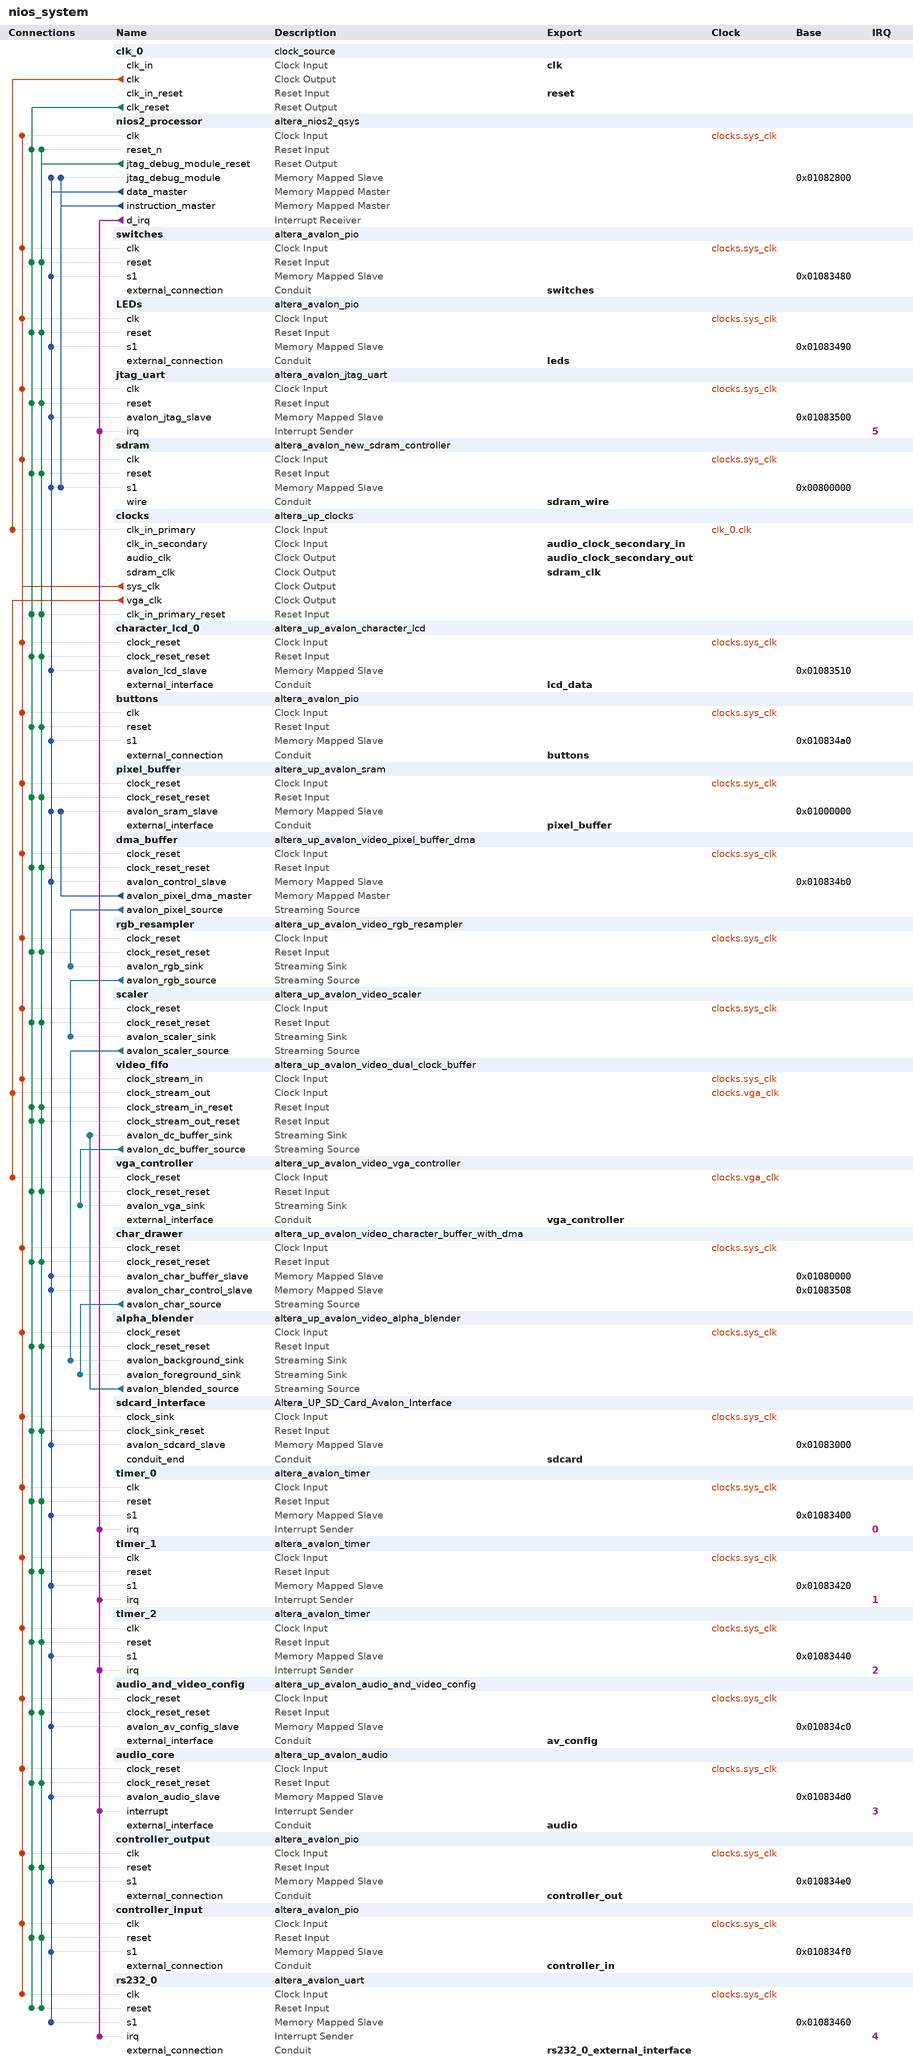
[diagram p0: system contents]
# Platform Designer (Qsys) system nios_system, Cyclone II EP2C35F672C6
# Parameters at their usual value, and those the tool derives, are not listed.
package require -exact qsys 12.0
create_system nios_system
set_project_property DEVICE_FAMILY {Cyclone II}
set_project_property DEVICE EP2C35F672C6

add_instance clk_0 clock_source 12.0
set_instance_parameter_value clk_0 clockFrequency 50000000

add_instance nios2_processor altera_nios2_qsys 12.0
set_instance_parameter_value nios2_processor muldiv_divider true
set_instance_parameter_value nios2_processor resetSlave sdram.s1
set_instance_parameter_value nios2_processor exceptionSlave sdram.s1
set_instance_parameter_value nios2_processor breakSlave nios2_processor.jtag_debug_module
set_instance_parameter_value nios2_processor impl Fast
set_instance_parameter_value nios2_processor icache_size 16384

add_instance switches altera_avalon_pio 12.0
set_instance_parameter_value switches direction Input
set_instance_parameter_value switches width 8

add_instance LEDs altera_avalon_pio 12.0
set_instance_parameter_value LEDs direction Output
set_instance_parameter_value LEDs width 8

add_instance jtag_uart altera_avalon_jtag_uart 12.0
set_instance_parameter_value jtag_uart simInteractiveOptions INTERACTIVE_ASCII_OUTPUT

add_instance sdram altera_avalon_new_sdram_controller 12.0
set_instance_parameter_value sdram TAC 5.5
set_instance_parameter_value sdram TRCD 20.0
set_instance_parameter_value sdram TRP 20.0
set_instance_parameter_value sdram casLatency 3
set_instance_parameter_value sdram columnWidth 8
set_instance_parameter_value sdram dataWidth 16
set_instance_parameter_value sdram generateSimulationModel false
set_instance_parameter_value sdram model custom
set_instance_parameter_value sdram numberOfBanks 4
set_instance_parameter_value sdram numberOfChipSelects 1
set_instance_parameter_value sdram powerUpDelay 100.0
set_instance_parameter_value sdram refreshPeriod 15.625
set_instance_parameter_value sdram rowWidth 12

add_instance clocks altera_up_clocks 12.0
set_instance_parameter_value clocks board DE2
set_instance_parameter_value clocks vga_clk true
set_instance_parameter_value clocks audio_clk true
set_instance_parameter_value clocks audio_clk_freq 12.288

add_instance character_lcd_0 altera_up_avalon_character_lcd 12.0
set_instance_parameter_value character_lcd_0 cursor Normal

add_instance buttons altera_avalon_pio 12.0
set_instance_parameter_value buttons direction Input
set_instance_parameter_value buttons width 4

add_instance pixel_buffer altera_up_avalon_sram 12.0
set_instance_parameter_value pixel_buffer board DE2
set_instance_parameter_value pixel_buffer pixel_buffer true

add_instance dma_buffer altera_up_avalon_video_pixel_buffer_dma 12.0
set_instance_parameter_value dma_buffer addr_mode Consecutive
set_instance_parameter_value dma_buffer start_address 0
set_instance_parameter_value dma_buffer back_start_address 0
set_instance_parameter_value dma_buffer image_width 320
set_instance_parameter_value dma_buffer image_height 240
set_instance_parameter_value dma_buffer color_space {16-bit RGB}

add_instance rgb_resampler altera_up_avalon_video_rgb_resampler 12.0
set_instance_parameter_value rgb_resampler input_type {16-bit RGB}
set_instance_parameter_value rgb_resampler output_type {30-bit RGB}
set_instance_parameter_value rgb_resampler alpha 1023

add_instance scaler altera_up_avalon_video_scaler 12.0
set_instance_parameter_value scaler width_scaling 2
set_instance_parameter_value scaler height_scaling 2
set_instance_parameter_value scaler width_in 320
set_instance_parameter_value scaler color_bits 10
set_instance_parameter_value scaler color_planes 3

add_instance video_fifo altera_up_avalon_video_dual_clock_buffer 12.0
set_instance_parameter_value video_fifo color_bits 10

add_instance vga_controller altera_up_avalon_video_vga_controller 12.0
set_instance_parameter_value vga_controller board DE2

add_instance char_drawer altera_up_avalon_video_character_buffer_with_dma 12.0
set_instance_parameter_value char_drawer enable_transparency true

add_instance alpha_blender altera_up_avalon_video_alpha_blender 12.0

add_instance sdcard_interface Altera_UP_SD_Card_Avalon_Interface 1.0

add_instance timer_0 altera_avalon_timer 12.0
set_instance_parameter_value timer_0 period 1
set_instance_parameter_value timer_0 periodUnits MSEC
set_instance_parameter_value timer_0 timerPreset FULL_FEATURED

add_instance timer_1 altera_avalon_timer 12.0
set_instance_parameter_value timer_1 period 1
set_instance_parameter_value timer_1 periodUnits MSEC
set_instance_parameter_value timer_1 timerPreset FULL_FEATURED

add_instance timer_2 altera_avalon_timer 12.0
set_instance_parameter_value timer_2 period 1
set_instance_parameter_value timer_2 periodUnits MSEC
set_instance_parameter_value timer_2 timerPreset FULL_FEATURED

add_instance audio_and_video_config altera_up_avalon_audio_and_video_config 12.0
set_instance_parameter_value audio_and_video_config board DE2
set_instance_parameter_value audio_and_video_config audio_in {Microphone to ADC}
set_instance_parameter_value audio_and_video_config line_in_bypass false
set_instance_parameter_value audio_and_video_config bit_length 16
set_instance_parameter_value audio_and_video_config sampling_rate {32 kHz}

add_instance audio_core altera_up_avalon_audio 12.0
set_instance_parameter_value audio_core avalon_bus_type {Memory Mapped}
set_instance_parameter_value audio_core audio_in true
set_instance_parameter_value audio_core dw 16

add_instance controller_output altera_avalon_pio 12.0
set_instance_parameter_value controller_output direction Output
set_instance_parameter_value controller_output width 8

add_instance controller_input altera_avalon_pio 12.0
set_instance_parameter_value controller_input direction Input
set_instance_parameter_value controller_input width 8

add_instance rs232_0 altera_avalon_uart 12.0
set_instance_parameter_value rs232_0 baud 115200
set_instance_parameter_value rs232_0 dataBits 8
set_instance_parameter_value rs232_0 fixedBaud true
set_instance_parameter_value rs232_0 parity NONE
set_instance_parameter_value rs232_0 stopBits 1

# connections
add_connection clk_0.clk clocks.clk_in_primary clock
add_connection clocks.sys_clk alpha_blender.clock_reset clock
add_connection clocks.sys_clk audio_and_video_config.clock_reset clock
add_connection clocks.sys_clk audio_core.clock_reset clock
add_connection clocks.sys_clk buttons.clk clock
add_connection clocks.sys_clk char_drawer.clock_reset clock
add_connection clocks.sys_clk character_lcd_0.clock_reset clock
add_connection clocks.sys_clk controller_input.clk clock
add_connection clocks.sys_clk controller_output.clk clock
add_connection clocks.sys_clk dma_buffer.clock_reset clock
add_connection clocks.sys_clk jtag_uart.clk clock
add_connection clocks.sys_clk LEDs.clk clock
add_connection clocks.sys_clk nios2_processor.clk clock
add_connection clocks.sys_clk pixel_buffer.clock_reset clock
add_connection clocks.sys_clk rgb_resampler.clock_reset clock
add_connection clocks.sys_clk rs232_0.clk clock
add_connection clocks.sys_clk scaler.clock_reset clock
add_connection clocks.sys_clk sdcard_interface.clock_sink clock
add_connection clocks.sys_clk sdram.clk clock
add_connection clocks.sys_clk switches.clk clock
add_connection clocks.sys_clk timer_0.clk clock
add_connection clocks.sys_clk timer_1.clk clock
add_connection clocks.sys_clk timer_2.clk clock
add_connection clocks.sys_clk video_fifo.clock_stream_in clock
add_connection clocks.vga_clk vga_controller.clock_reset clock
add_connection clocks.vga_clk video_fifo.clock_stream_out clock
add_connection clk_0.clk_reset alpha_blender.clock_reset_reset reset
add_connection clk_0.clk_reset audio_and_video_config.clock_reset_reset reset
add_connection clk_0.clk_reset audio_core.clock_reset_reset reset
add_connection clk_0.clk_reset buttons.reset reset
add_connection clk_0.clk_reset char_drawer.clock_reset_reset reset
add_connection clk_0.clk_reset character_lcd_0.clock_reset_reset reset
add_connection clk_0.clk_reset clocks.clk_in_primary_reset reset
add_connection clk_0.clk_reset controller_input.reset reset
add_connection clk_0.clk_reset controller_output.reset reset
add_connection clk_0.clk_reset dma_buffer.clock_reset_reset reset
add_connection clk_0.clk_reset jtag_uart.reset reset
add_connection clk_0.clk_reset LEDs.reset reset
add_connection clk_0.clk_reset nios2_processor.reset_n reset
add_connection clk_0.clk_reset pixel_buffer.clock_reset_reset reset
add_connection clk_0.clk_reset rgb_resampler.clock_reset_reset reset
add_connection clk_0.clk_reset rs232_0.reset reset
add_connection clk_0.clk_reset scaler.clock_reset_reset reset
add_connection clk_0.clk_reset sdcard_interface.clock_sink_reset reset
add_connection clk_0.clk_reset sdram.reset reset
add_connection clk_0.clk_reset switches.reset reset
add_connection clk_0.clk_reset timer_0.reset reset
add_connection clk_0.clk_reset timer_1.reset reset
add_connection clk_0.clk_reset timer_2.reset reset
add_connection clk_0.clk_reset vga_controller.clock_reset_reset reset
add_connection clk_0.clk_reset video_fifo.clock_stream_in_reset reset
add_connection clk_0.clk_reset video_fifo.clock_stream_out_reset reset
add_connection nios2_processor.jtag_debug_module_reset alpha_blender.clock_reset_reset reset
add_connection nios2_processor.jtag_debug_module_reset audio_and_video_config.clock_reset_reset reset
add_connection nios2_processor.jtag_debug_module_reset audio_core.clock_reset_reset reset
add_connection nios2_processor.jtag_debug_module_reset buttons.reset reset
add_connection nios2_processor.jtag_debug_module_reset char_drawer.clock_reset_reset reset
add_connection nios2_processor.jtag_debug_module_reset character_lcd_0.clock_reset_reset reset
add_connection nios2_processor.jtag_debug_module_reset clocks.clk_in_primary_reset reset
add_connection nios2_processor.jtag_debug_module_reset controller_input.reset reset
add_connection nios2_processor.jtag_debug_module_reset controller_output.reset reset
add_connection nios2_processor.jtag_debug_module_reset dma_buffer.clock_reset_reset reset
add_connection nios2_processor.jtag_debug_module_reset jtag_uart.reset reset
add_connection nios2_processor.jtag_debug_module_reset LEDs.reset reset
add_connection nios2_processor.jtag_debug_module_reset nios2_processor.reset_n reset
add_connection nios2_processor.jtag_debug_module_reset pixel_buffer.clock_reset_reset reset
add_connection nios2_processor.jtag_debug_module_reset rgb_resampler.clock_reset_reset reset
add_connection nios2_processor.jtag_debug_module_reset rs232_0.reset reset
add_connection nios2_processor.jtag_debug_module_reset scaler.clock_reset_reset reset
add_connection nios2_processor.jtag_debug_module_reset sdcard_interface.clock_sink_reset reset
add_connection nios2_processor.jtag_debug_module_reset sdram.reset reset
add_connection nios2_processor.jtag_debug_module_reset switches.reset reset
add_connection nios2_processor.jtag_debug_module_reset timer_0.reset reset
add_connection nios2_processor.jtag_debug_module_reset timer_1.reset reset
add_connection nios2_processor.jtag_debug_module_reset timer_2.reset reset
add_connection nios2_processor.jtag_debug_module_reset vga_controller.clock_reset_reset reset
add_connection nios2_processor.jtag_debug_module_reset video_fifo.clock_stream_in_reset reset
add_connection nios2_processor.jtag_debug_module_reset video_fifo.clock_stream_out_reset reset
add_connection dma_buffer.avalon_pixel_dma_master pixel_buffer.avalon_sram_slave avalon
set_connection_parameter_value dma_buffer.avalon_pixel_dma_master/pixel_buffer.avalon_sram_slave baseAddress 0x01000000
add_connection nios2_processor.data_master audio_and_video_config.avalon_av_config_slave avalon
set_connection_parameter_value nios2_processor.data_master/audio_and_video_config.avalon_av_config_slave baseAddress 0x010834c0
add_connection nios2_processor.data_master audio_core.avalon_audio_slave avalon
set_connection_parameter_value nios2_processor.data_master/audio_core.avalon_audio_slave baseAddress 0x010834d0
add_connection nios2_processor.data_master buttons.s1 avalon
set_connection_parameter_value nios2_processor.data_master/buttons.s1 baseAddress 0x010834a0
add_connection nios2_processor.data_master char_drawer.avalon_char_buffer_slave avalon
set_connection_parameter_value nios2_processor.data_master/char_drawer.avalon_char_buffer_slave baseAddress 0x01080000
add_connection nios2_processor.data_master char_drawer.avalon_char_control_slave avalon
set_connection_parameter_value nios2_processor.data_master/char_drawer.avalon_char_control_slave baseAddress 0x01083508
add_connection nios2_processor.data_master character_lcd_0.avalon_lcd_slave avalon
set_connection_parameter_value nios2_processor.data_master/character_lcd_0.avalon_lcd_slave baseAddress 0x01083510
add_connection nios2_processor.data_master controller_input.s1 avalon
set_connection_parameter_value nios2_processor.data_master/controller_input.s1 baseAddress 0x010834f0
add_connection nios2_processor.data_master controller_output.s1 avalon
set_connection_parameter_value nios2_processor.data_master/controller_output.s1 baseAddress 0x010834e0
add_connection nios2_processor.data_master dma_buffer.avalon_control_slave avalon
set_connection_parameter_value nios2_processor.data_master/dma_buffer.avalon_control_slave baseAddress 0x010834b0
add_connection nios2_processor.data_master jtag_uart.avalon_jtag_slave avalon
set_connection_parameter_value nios2_processor.data_master/jtag_uart.avalon_jtag_slave baseAddress 0x01083500
add_connection nios2_processor.data_master LEDs.s1 avalon
set_connection_parameter_value nios2_processor.data_master/LEDs.s1 baseAddress 0x01083490
add_connection nios2_processor.data_master nios2_processor.jtag_debug_module avalon
set_connection_parameter_value nios2_processor.data_master/nios2_processor.jtag_debug_module baseAddress 0x01082800
add_connection nios2_processor.data_master pixel_buffer.avalon_sram_slave avalon
set_connection_parameter_value nios2_processor.data_master/pixel_buffer.avalon_sram_slave baseAddress 0x01000000
add_connection nios2_processor.data_master rs232_0.s1 avalon
set_connection_parameter_value nios2_processor.data_master/rs232_0.s1 baseAddress 0x01083460
add_connection nios2_processor.data_master sdcard_interface.avalon_sdcard_slave avalon
set_connection_parameter_value nios2_processor.data_master/sdcard_interface.avalon_sdcard_slave baseAddress 0x01083000
add_connection nios2_processor.data_master sdram.s1 avalon
set_connection_parameter_value nios2_processor.data_master/sdram.s1 baseAddress 0x00800000
add_connection nios2_processor.data_master switches.s1 avalon
set_connection_parameter_value nios2_processor.data_master/switches.s1 baseAddress 0x01083480
add_connection nios2_processor.data_master timer_0.s1 avalon
set_connection_parameter_value nios2_processor.data_master/timer_0.s1 baseAddress 0x01083400
add_connection nios2_processor.data_master timer_1.s1 avalon
set_connection_parameter_value nios2_processor.data_master/timer_1.s1 baseAddress 0x01083420
add_connection nios2_processor.data_master timer_2.s1 avalon
set_connection_parameter_value nios2_processor.data_master/timer_2.s1 baseAddress 0x01083440
add_connection nios2_processor.instruction_master nios2_processor.jtag_debug_module avalon
set_connection_parameter_value nios2_processor.instruction_master/nios2_processor.jtag_debug_module baseAddress 0x01082800
add_connection nios2_processor.instruction_master sdram.s1 avalon
set_connection_parameter_value nios2_processor.instruction_master/sdram.s1 baseAddress 0x00800000
add_connection alpha_blender.avalon_blended_source video_fifo.avalon_dc_buffer_sink avalon_streaming
add_connection char_drawer.avalon_char_source alpha_blender.avalon_foreground_sink avalon_streaming
add_connection dma_buffer.avalon_pixel_source rgb_resampler.avalon_rgb_sink avalon_streaming
add_connection rgb_resampler.avalon_rgb_source scaler.avalon_scaler_sink avalon_streaming
add_connection scaler.avalon_scaler_source alpha_blender.avalon_background_sink avalon_streaming
add_connection video_fifo.avalon_dc_buffer_source vga_controller.avalon_vga_sink avalon_streaming
add_connection nios2_processor.d_irq audio_core.interrupt interrupt
set_connection_parameter_value nios2_processor.d_irq/audio_core.interrupt irqNumber 3
add_connection nios2_processor.d_irq jtag_uart.irq interrupt
set_connection_parameter_value nios2_processor.d_irq/jtag_uart.irq irqNumber 5
add_connection nios2_processor.d_irq rs232_0.irq interrupt
set_connection_parameter_value nios2_processor.d_irq/rs232_0.irq irqNumber 4
add_connection nios2_processor.d_irq timer_0.irq interrupt
set_connection_parameter_value nios2_processor.d_irq/timer_0.irq irqNumber 0
add_connection nios2_processor.d_irq timer_1.irq interrupt
set_connection_parameter_value nios2_processor.d_irq/timer_1.irq irqNumber 1
add_connection nios2_processor.d_irq timer_2.irq interrupt
set_connection_parameter_value nios2_processor.d_irq/timer_2.irq irqNumber 2

# exported interfaces
add_interface clk clock sink
set_interface_property clk EXPORT_OF clk_0.clk_in
add_interface reset reset sink
set_interface_property reset EXPORT_OF clk_0.clk_in_reset
add_interface switches conduit end
set_interface_property switches EXPORT_OF switches.external_connection
add_interface leds conduit end
set_interface_property leds EXPORT_OF LEDs.external_connection
add_interface sdram_wire conduit end
set_interface_property sdram_wire EXPORT_OF sdram.wire
add_interface sdram_clk clock source
set_interface_property sdram_clk EXPORT_OF clocks.sdram_clk
add_interface lcd_data conduit end
set_interface_property lcd_data EXPORT_OF character_lcd_0.external_interface
add_interface buttons conduit end
set_interface_property buttons EXPORT_OF buttons.external_connection
add_interface pixel_buffer conduit end
set_interface_property pixel_buffer EXPORT_OF pixel_buffer.external_interface
add_interface vga_controller conduit end
set_interface_property vga_controller EXPORT_OF vga_controller.external_interface
add_interface sdcard conduit end
set_interface_property sdcard EXPORT_OF sdcard_interface.conduit_end
add_interface av_config conduit end
set_interface_property av_config EXPORT_OF audio_and_video_config.external_interface
add_interface audio conduit end
set_interface_property audio EXPORT_OF audio_core.external_interface
add_interface audio_clock_secondary_in clock sink
set_interface_property audio_clock_secondary_in EXPORT_OF clocks.clk_in_secondary
add_interface audio_clock_secondary_out clock source
set_interface_property audio_clock_secondary_out EXPORT_OF clocks.audio_clk
add_interface controller_out conduit end
set_interface_property controller_out EXPORT_OF controller_output.external_connection
add_interface controller_in conduit end
set_interface_property controller_in EXPORT_OF controller_input.external_connection
add_interface rs232_0_external_interface conduit end
set_interface_property rs232_0_external_interface EXPORT_OF rs232_0.external_connection

save_system nios_system.qsys
